# Altium schematic sheet CONSOLE.SchDoc
size 420 x 297 mm; SheetNumber: 13; SheetTotal: 24
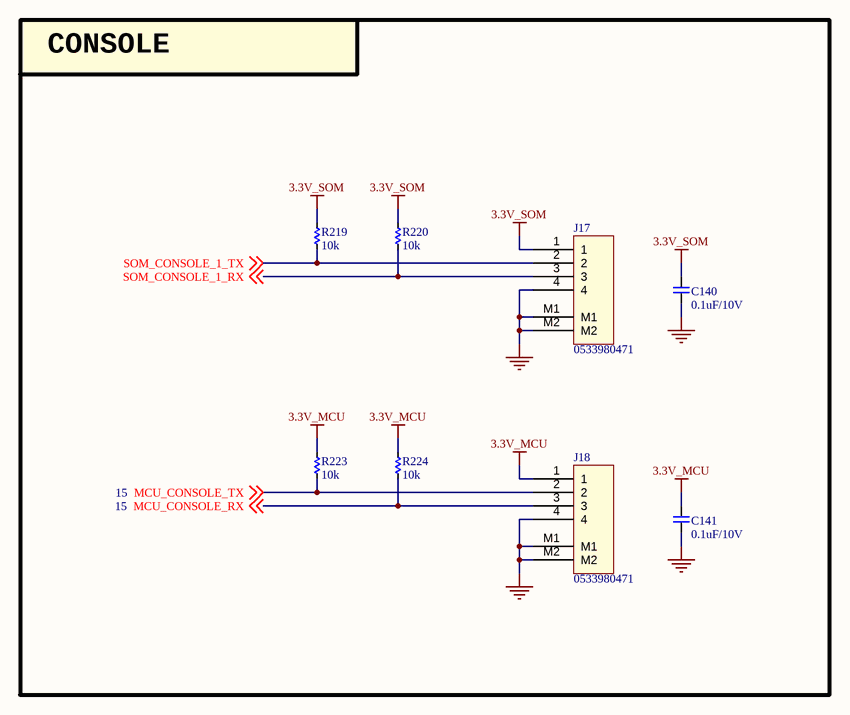
[diagram p0: CONSOLE.SchDoc]

## Parts
C140  0.1uF/10V  [CAP_C_1005X60]
C141  0.1uF/10V  [CAP_C_1005X60]
J17  0533980471  [MOLEX_0533980471]
J18  0533980471  [MOLEX_0533980471]
R219  10k  [RES_C_1005X40]
R220  10k  [RES_C_1005X40]
R223  10k  [RES_C_1005X40]
R224  10k  [RES_C_1005X40]

## Blocks framed on the sheet
CONSOLE: C140 C141 J17 J18 R219 R220 R223 R224

## Nets
3.3V_MCU: C141.2 J18.1 R223.2 R224.2
3.3V_SOM: C140.2 J17.1 R219.2 R220.2
GND: C140.1 C141.1 J17.4 J17.M1 J17.M2 J18.4 J18.M1 J18.M2
MCU_CONSOLE_RX: J18.3 R224.1 ; off-sheet MCU_CONSOLE_RX
MCU_CONSOLE_TX: J18.2 R223.1 ; off-sheet MCU_CONSOLE_TX
SOM_CONSOLE_1_RX: J17.3 R220.1 ; off-sheet SOM_CONSOLE_1_RX
SOM_CONSOLE_1_TX: J17.2 R219.1 ; off-sheet SOM_CONSOLE_1_TX

## Notes on the sheet
- Project:
- BEE-PC1
- Sub-system:
- NANORACK_EXP_CONTROLLER
- Design by:
- SANG HUYNH
- BAO BUI Q.
- Sheet title:
- Sheet
- A3
- of
- Checked by:
- Approved by:
- VU PHAM
- Revision:
- Document No:
- V1.2.2
- Size:
- Date:

## Library data of the parts
C140 C141 = _CAP_C_2: CAP CHIP
J17 J18 = Header 4x1_2M
R219 R220 R223 R224 = _RES_B_2: RES